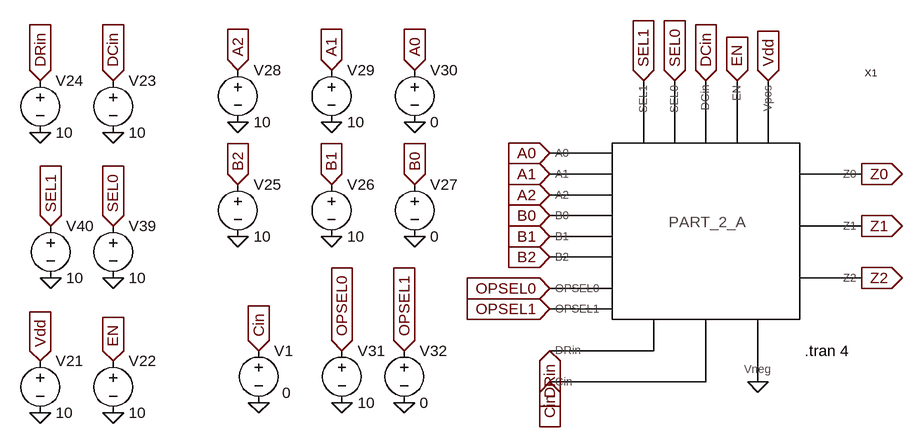
[diagram p0: schematic PART_2_A_TESTING.asc]
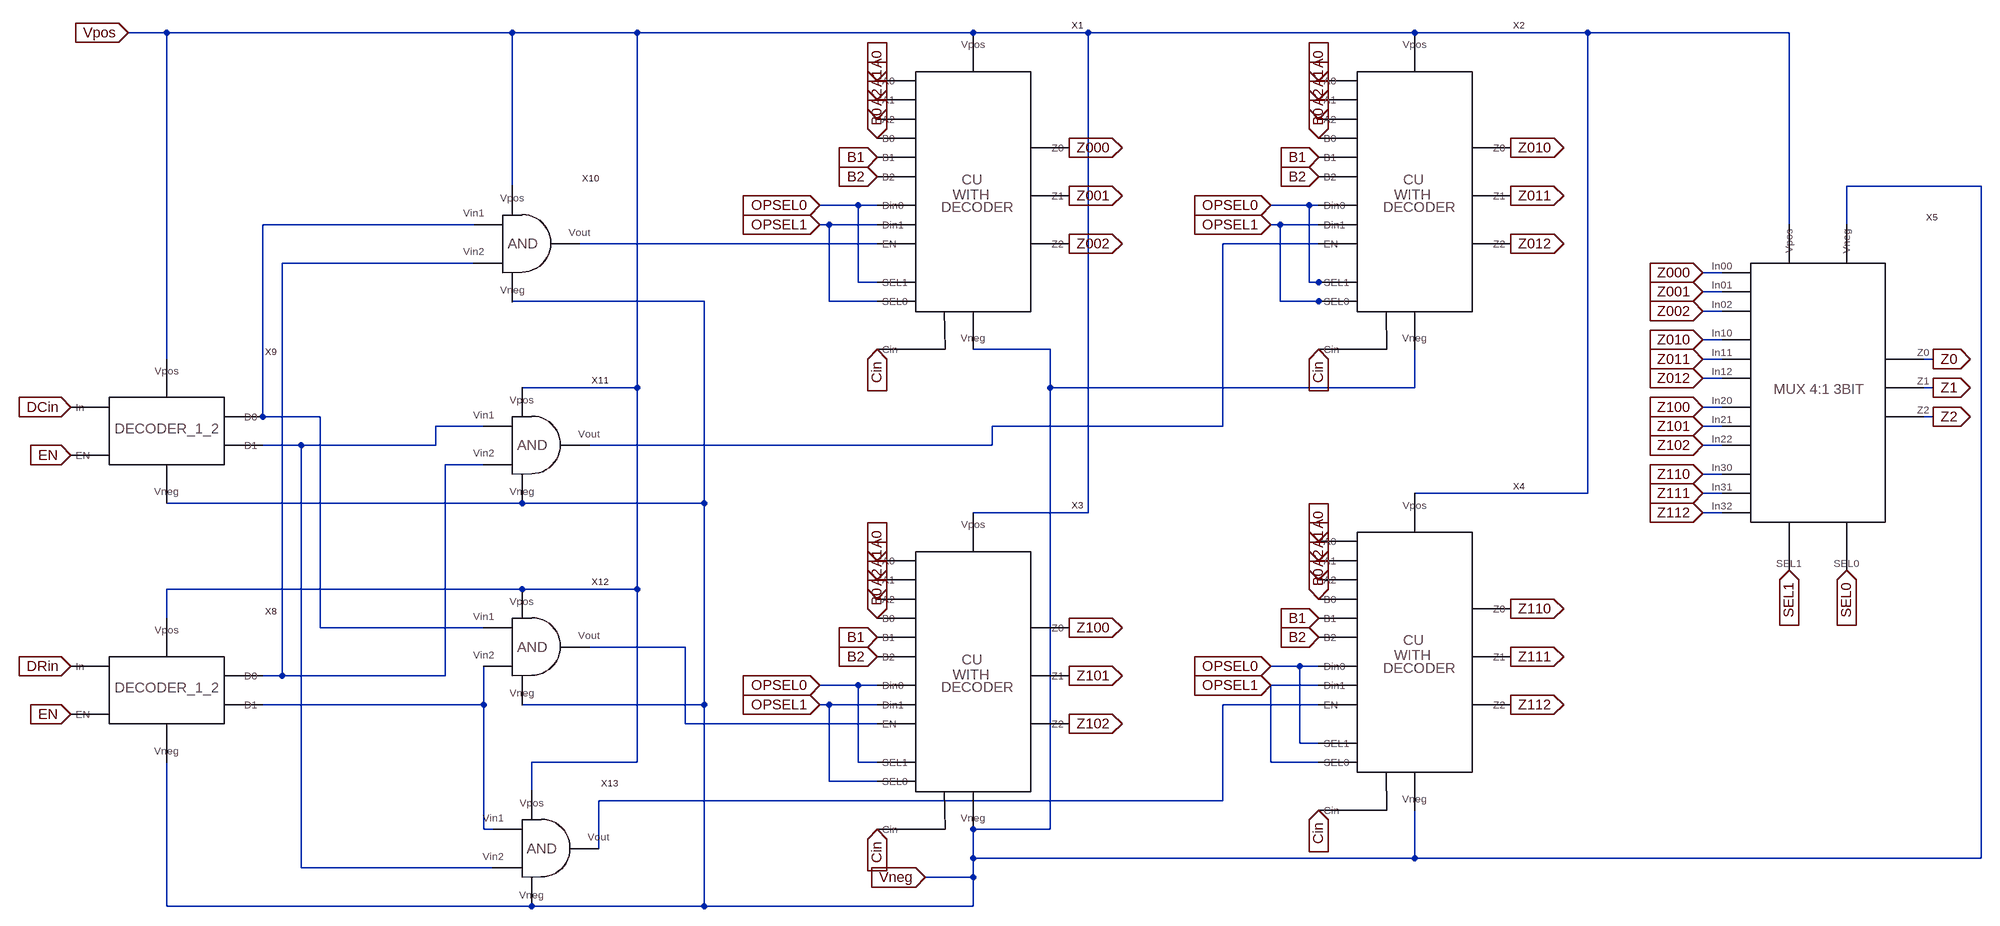
[diagram p1: sub-circuit part_2_a_sym.asc]
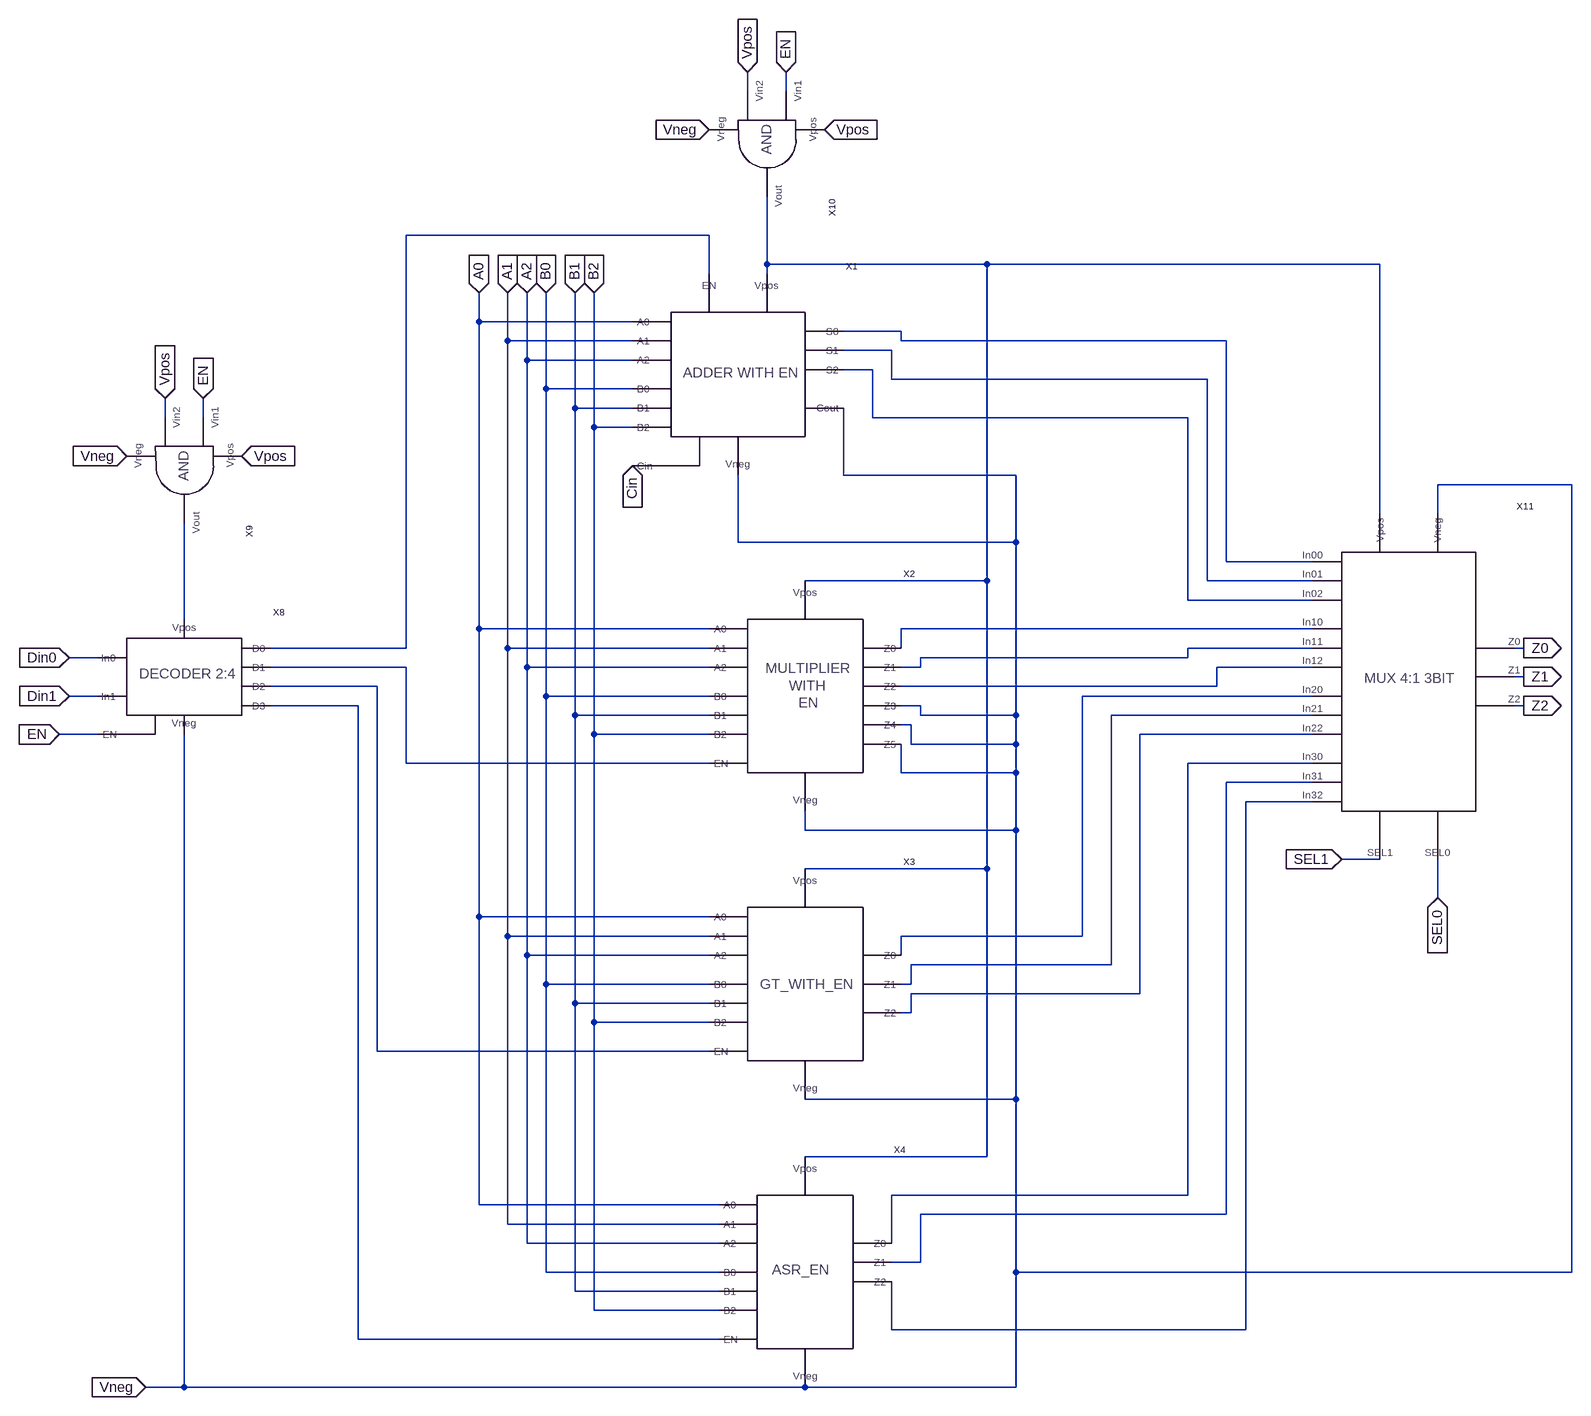
[diagram p2: sub-circuit part_2_b_sym.asc]
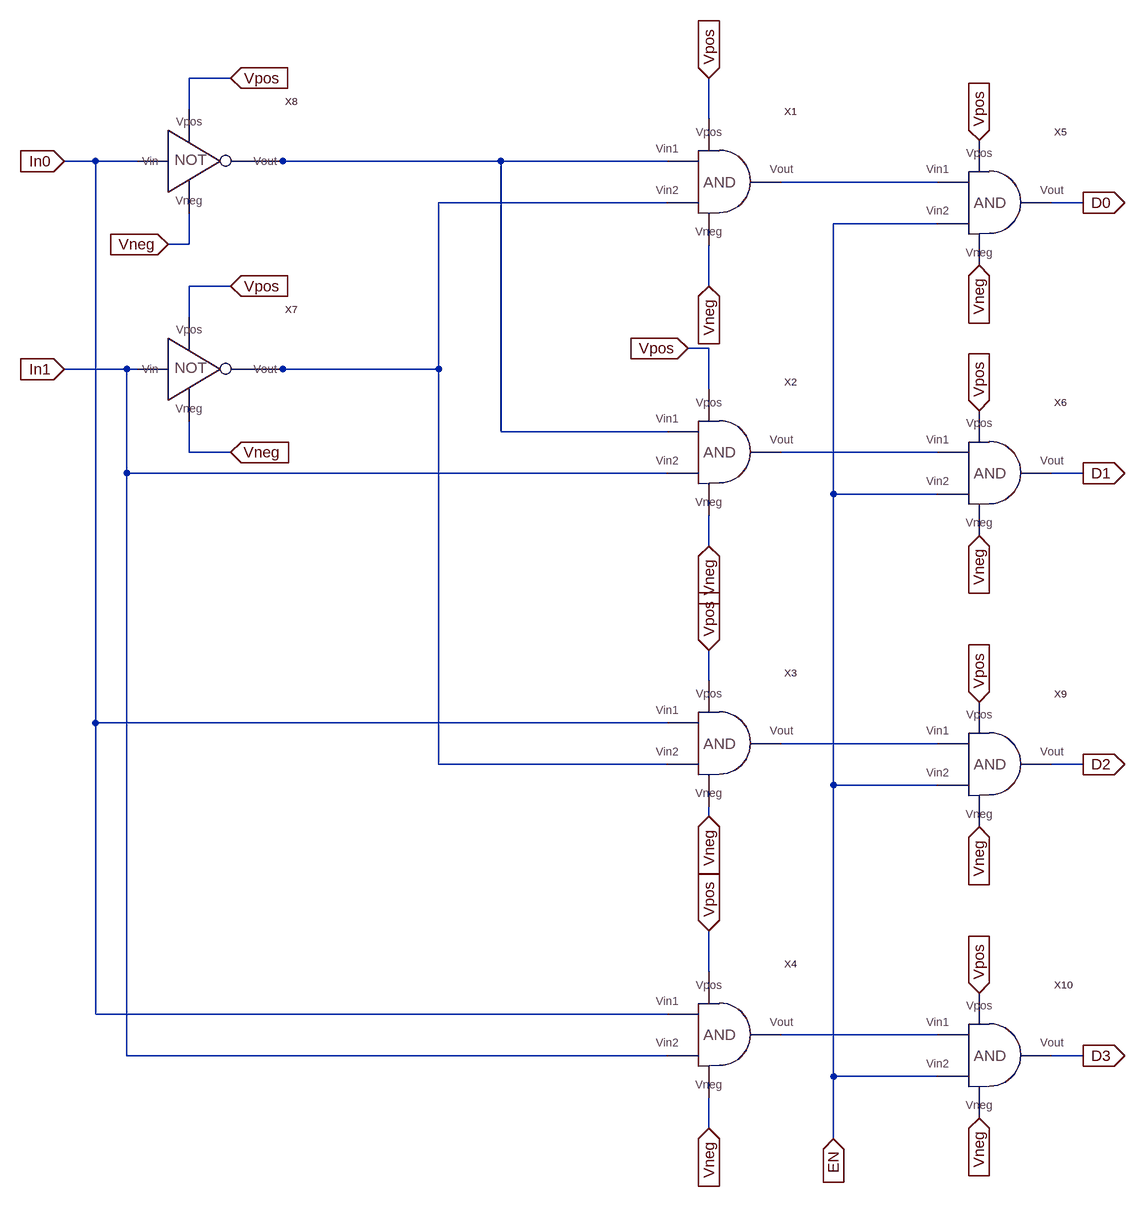
[diagram p3: sub-circuit decoder2_4.asc]
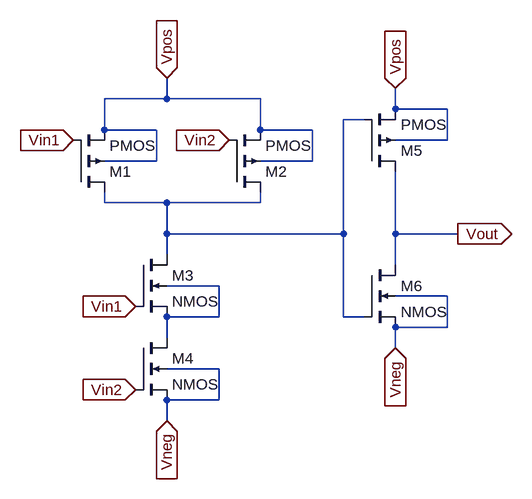
[diagram p4: sub-circuit and_sym.asc]
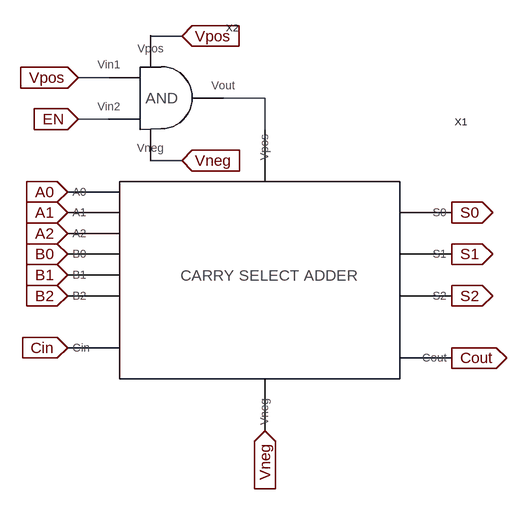
[diagram p5: sub-circuit adder_en_sym.asc]
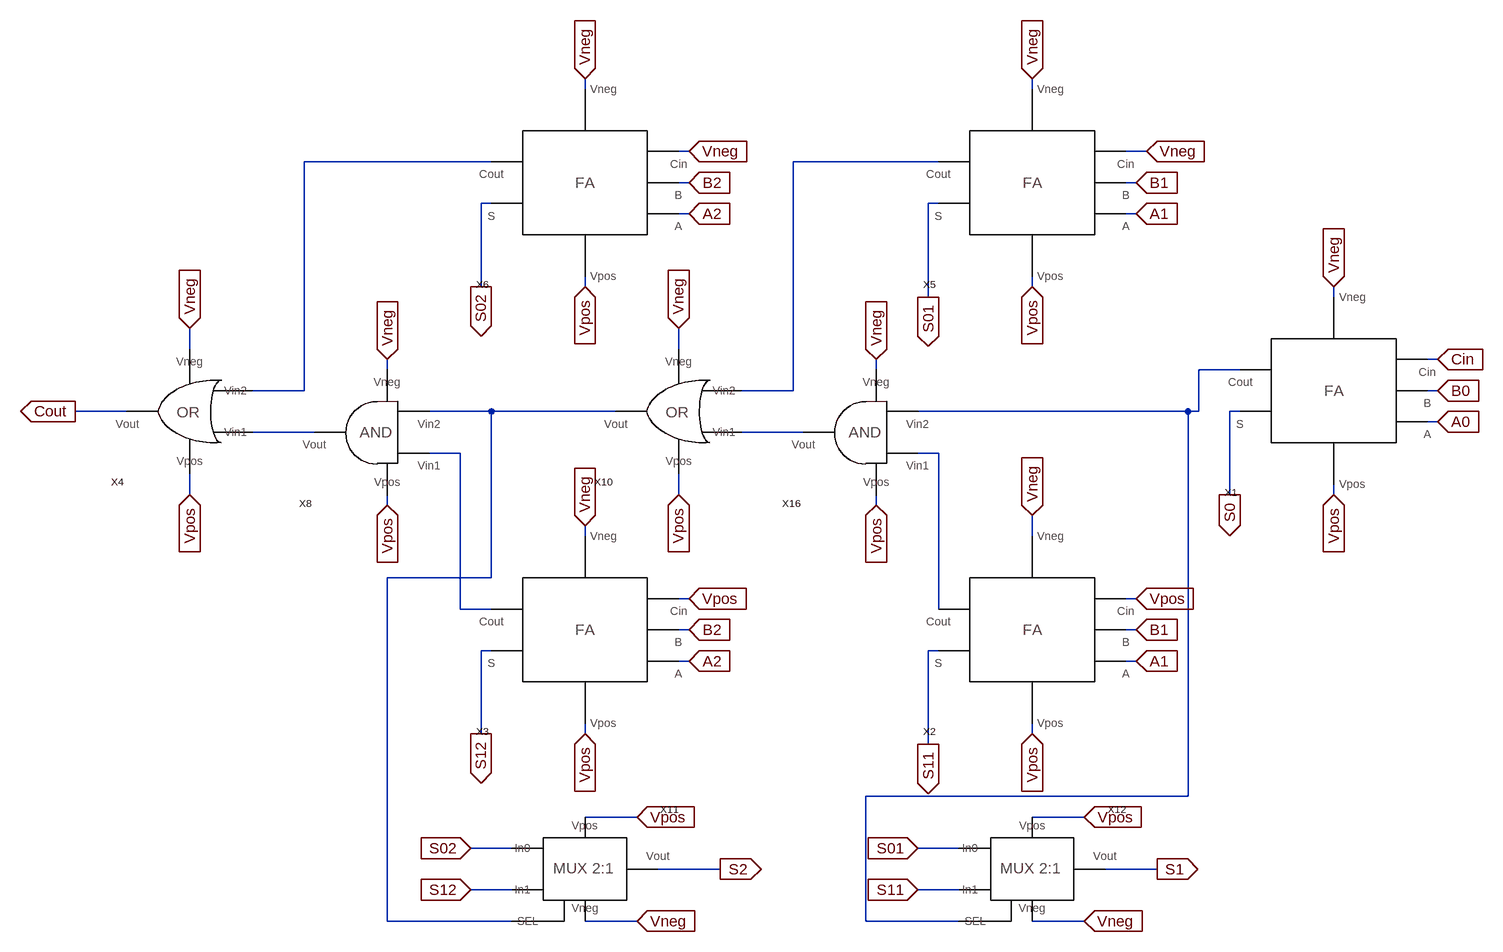
[diagram p6: sub-circuit carry_select_adder_sym.asc]
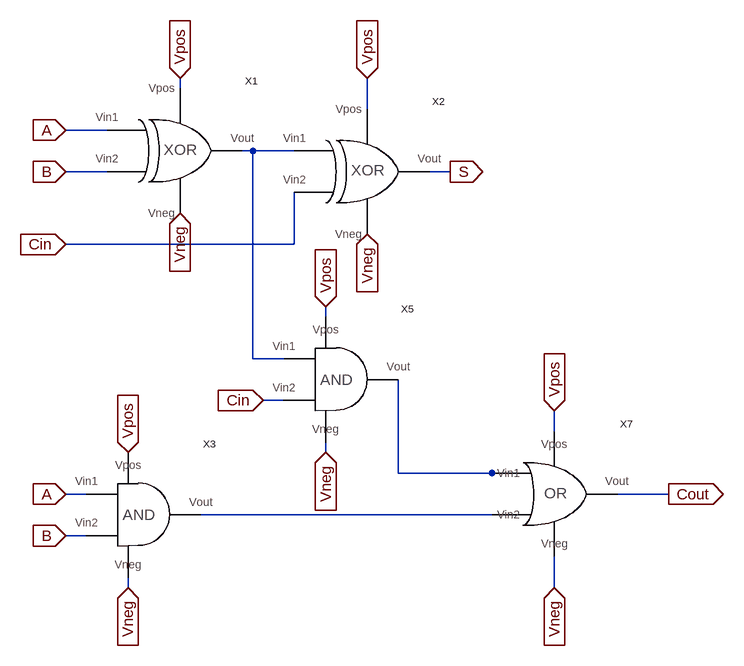
[diagram p7: sub-circuit full_adder_sym.asc]
PART_2_A_TESTING.asc, the LTspice schematic file:
Version 4
SHEET 1 5000 1080
FLAG 3232 -208 A0
IOPIN 3232 -208 In
FLAG 3232 -176 A1
IOPIN 3232 -176 In
FLAG 3232 -144 A2
IOPIN 3232 -144 In
FLAG 3232 -112 B0
IOPIN 3232 -112 In
FLAG 3232 -80 B1
IOPIN 3232 -80 In
FLAG 3232 -48 B2
IOPIN 3232 -48 In
FLAG 3424 -320 SEL0
IOPIN 3424 -320 In
FLAG 3232 96 DRin
IOPIN 3232 96 In
FLAG 3712 -176 Z0
IOPIN 3712 -176 Out
FLAG 3712 -96 Z1
IOPIN 3712 -96 Out
FLAG 3712 -16 Z2
IOPIN 3712 -16 Out
FLAG 2448 112 Vdd
IOPIN 2448 112 In
FLAG 2560 -320 DCin
IOPIN 2560 -320 In
FLAG 2448 -320 DRin
IOPIN 2448 -320 In
FLAG 2560 112 EN
IOPIN 2560 112 In
FLAG 2752 -336 A2
IOPIN 2752 -336 In
FLAG 2896 -336 A1
IOPIN 2896 -336 In
FLAG 3024 -336 A0
IOPIN 3024 -336 In
FLAG 2752 -160 B2
IOPIN 2752 -160 In
FLAG 2896 -160 B1
IOPIN 2896 -160 In
FLAG 3024 -160 B0
IOPIN 3024 -160 In
FLAG 2448 192 0
FLAG 2560 192 0
FLAG 2560 -240 0
FLAG 2448 -240 0
FLAG 3024 -256 0
FLAG 2896 -256 0
FLAG 2752 -256 0
FLAG 2752 -80 0
FLAG 2896 -80 0
FLAG 3024 -80 0
FLAG 2560 -96 SEL0
IOPIN 2560 -96 In
FLAG 2464 -96 SEL1
IOPIN 2464 -96 In
FLAG 2912 96 OPSEL0
IOPIN 2912 96 In
FLAG 3008 96 OPSEL1
IOPIN 3008 96 In
FLAG 2912 176 0
FLAG 3008 176 0
FLAG 2464 -16 0
FLAG 2560 -16 0
FLAG 3552 144 0
FLAG 3568 -320 Vdd
IOPIN 3568 -320 In
FLAG 3520 -320 EN
IOPIN 3520 -320 In
FLAG 3472 -320 DCin
IOPIN 3472 -320 In
FLAG 3376 -320 SEL1
IOPIN 3376 -320 In
FLAG 3232 144 Cin
IOPIN 3232 144 In
FLAG 2784 96 Cin
IOPIN 2784 96 In
FLAG 2784 176 0
FLAG 3232 32 OPSEL1
IOPIN 3232 32 In
FLAG 3232 0 OPSEL0
IOPIN 3232 0 In
SYMBOL voltage 2448 96 R0
WINDOW 123 0 0 Left 0
WINDOW 39 0 0 Left 0
SYMATTR InstName V21
SYMATTR Value 10
SYMBOL voltage 2560 96 R0
WINDOW 123 0 0 Left 0
WINDOW 39 0 0 Left 0
SYMATTR InstName V22
SYMATTR Value 10
SYMBOL voltage 2560 -336 R0
WINDOW 123 0 0 Left 0
WINDOW 39 0 0 Left 0
SYMATTR InstName V23
SYMATTR Value 10
SYMBOL voltage 2448 -336 R0
WINDOW 123 0 0 Left 0
WINDOW 39 0 0 Left 0
SYMATTR InstName V24
SYMATTR Value 10
SYMBOL voltage 2752 -176 R0
WINDOW 123 0 0 Left 0
WINDOW 39 0 0 Left 0
SYMATTR InstName V25
SYMATTR Value 10
SYMBOL voltage 2896 -176 R0
WINDOW 123 0 0 Left 0
WINDOW 39 0 0 Left 0
SYMATTR InstName V26
SYMATTR Value 10
SYMBOL voltage 3024 -176 R0
WINDOW 123 0 0 Left 0
WINDOW 39 0 0 Left 0
SYMATTR InstName V27
SYMATTR Value 0
SYMBOL voltage 2752 -352 R0
WINDOW 123 0 0 Left 0
WINDOW 39 0 0 Left 0
SYMATTR InstName V28
SYMATTR Value 10
SYMBOL voltage 2896 -352 R0
WINDOW 123 0 0 Left 0
WINDOW 39 0 0 Left 0
SYMATTR InstName V29
SYMATTR Value 10
SYMBOL voltage 3024 -352 R0
WINDOW 123 0 0 Left 0
WINDOW 39 0 0 Left 0
SYMATTR InstName V30
SYMATTR Value 0
SYMBOL voltage 2912 80 R0
WINDOW 123 0 0 Left 0
WINDOW 39 0 0 Left 0
SYMATTR InstName V31
SYMATTR Value 10
SYMBOL voltage 3008 80 R0
WINDOW 123 0 0 Left 0
WINDOW 39 0 0 Left 0
SYMATTR InstName V32
SYMATTR Value 0
SYMBOL voltage 2560 -112 R0
WINDOW 123 0 0 Left 0
WINDOW 39 0 0 Left 0
SYMATTR InstName V39
SYMATTR Value 10
SYMBOL voltage 2464 -112 R0
WINDOW 123 0 0 Left 0
WINDOW 39 0 0 Left 0
SYMATTR InstName V40
SYMATTR Value 10
SYMBOL PART_2_A_SYM 3472 -48 R0
SYMATTR InstName X1
SYMBOL voltage 2784 80 R0
WINDOW 123 0 0 Left 0
WINDOW 39 0 0 Left 0
WINDOW 3 36 81 Left 2
SYMATTR Value 0
SYMATTR InstName V1
TEXT 3624 96 Left 2 !.tran 4

The netlist it stands for:
* PART_2_A_TESTING.asc
V21 Vdd 0 10
V22 EN 0 10
V23 DCin 0 10
V24 DRin 0 10
V25 B2 0 10
V26 B1 0 10
V27 B0 0 0
V28 A2 0 10
V29 A1 0 10
V30 A0 0 0
V31 OPSEL0 0 10
V32 OPSEL1 0 0
V39 SEL0 0 10
V40 SEL1 0 10
XX1 A0 A1 A2 B0 B1 B2 OPSEL0 OPSEL1 DRin Cin 0 Z2 Z1 Z0 Vdd EN DCin SEL0 SEL1 part_2_a_sym
V1 Cin 0 0

* block symbol definitions
.subckt part_2_a_sym A0 A1 A2 B0 B1 B2 OPSEL0 OPSEL1 DRin Cin Vneg Z2 Z1 Z0 Vpos EN DCin SEL0 SEL1
XX1 A0 A1 A2 B0 B1 B2 OPSEL0 OPSEL1 N002 OPSEL0 OPSEL1 Vpos Vneg Z000 Z001 Z002 Cin part_2_b_sym
XX2 A0 A1 A2 B0 B1 B2 OPSEL0 OPSEL1 N003 OPSEL0 OPSEL1 Vpos Vneg Z010 Z011 Z012 Cin part_2_b_sym
XX3 A0 A1 A2 B0 B1 B2 OPSEL0 OPSEL1 N006 OPSEL0 OPSEL1 Vpos Vneg Z100 Z101 Z102 Cin part_2_b_sym
XX4 A0 A1 A2 B0 B1 B2 OPSEL0 OPSEL1 N008 OPSEL0 OPSEL1 Vpos Vneg Z110 Z111 Z112 Cin part_2_b_sym
XX8 DRin EN Vpos Vneg N004 N007 decoder_1_2_sym
XX9 DCin EN Vpos Vneg N001 N005 decoder_1_2_sym
XX10 N001 N004 Vpos Vneg N002 and_sym
XX11 N005 N004 Vpos Vneg N003 and_sym
XX12 N001 N007 Vpos Vneg N006 and_sym
XX13 N007 N005 Vpos Vneg N008 and_sym
XX5 Vpos Vneg Z000 Z001 Z002 Z010 Z011 Z012 Z100 Z101 Z102 Z110 Z111 Z112 Z0 Z1 Z2 SEL0 SEL1 mux3bit_sym
.ends part_2_a_sym

.subckt part_2_b_sym A0 A1 A2 B0 B1 B2 Din0 Din1 EN SEL1 SEL0 Vpos Vneg Z0 Z1 Z2 Cin
XX8 Din0 Din1 N001 N009 N011 N013 Vneg N006 EN decoder2_4
XX1 A0 A1 A2 B0 B1 B2 N002 N001 Vneg N003 N004 N005 Vneg Cin adder_en_sym
XX2 A0 A1 A2 B0 B1 B2 N009 N002 N007 Vneg N008 N010 Vneg Vneg Vneg multiplier_en_sym
XX3 A0 A1 A2 B0 B1 B2 N011 N002 N012 N014 N015 Vneg gt_en_sym
XX4 N002 A0 A1 A2 B0 B1 B2 N013 Vneg N016 N017 N018 asr_en_sym
XX9 EN Vpos Vpos Vneg N006 and_sym
XX10 EN Vpos Vpos Vneg N002 and_sym
XX11 N002 Vneg N003 N004 N005 N007 N008 N010 N012 N014 N015 N016 N017 N018 Z0 Z1 Z2 SEL0 SEL1 mux3bit_sym
.ends part_2_b_sym

.subckt decoder2_4 In0 In1 D0 D1 D2 D3 Vneg Vpos EN
XX1 N001 N003 Vpos Vneg N002 and_sym
XX2 N001 In1 Vpos Vneg N004 and_sym
XX3 In0 N003 Vpos Vneg N005 and_sym
XX4 In0 In1 Vpos Vneg N006 and_sym
XX7 In1 Vpos N003 Vneg NOT_SYM  ; pins Vin Vpos Vout Vneg
XX8 In0 Vpos N001 Vneg NOT_SYM  ; pins Vin Vpos Vout Vneg
XX5 N002 EN Vpos Vneg D0 and_sym
XX6 N004 EN Vpos Vneg D1 and_sym
XX9 N005 EN Vpos Vneg D2 and_sym
XX10 N006 EN Vpos Vneg D3 and_sym
.ends decoder2_4

.subckt and_sym Vin1 Vin2 Vpos Vneg Vout
M1 N001 Vin1 Vpos Vpos PMOS
M2 N001 Vin2 Vpos Vpos PMOS
M3 N001 Vin1 N002 N002 NMOS
M4 N002 Vin2 Vneg Vneg NMOS
M5 Vout N001 Vpos Vpos PMOS
M6 Vout N001 Vneg Vneg NMOS
.ends and_sym

.subckt adder_en_sym A0 A1 A2 B0 B1 B2 Vpos EN Vneg S0 S1 S2 Cout Cin
XX1 A0 A1 A2 B0 B1 B2 Cout N001 Vneg S0 S1 S2 Cin carry_select_adder_sym
XX2 Vpos EN Vpos Vneg N001 and_sym
.ends adder_en_sym

.subckt carry_select_adder_sym A0 A1 A2 B0 B1 B2 Cout Vpos Vneg S0 S1 S2 Cin
XX1 A0 B0 Cin S0 N003 Vpos Vneg full_adder_sym
XX2 A1 B1 Vpos S11 N008 Vpos Vneg full_adder_sym
XX3 A2 B2 Vpos S12 N007 Vpos Vneg full_adder_sym
XX5 A1 B1 Vneg S01 N002 Vpos Vneg full_adder_sym
XX6 A2 B2 Vneg S02 N001 Vpos Vneg full_adder_sym
XX10 Vpos N006 N002 N004 Vneg or_sym
XX11 S02 S12 N004 Vpos Vneg S2 mux2_1
XX12 S01 S11 N003 Vpos Vneg S1 mux2_1
XX16 N008 N003 Vpos Vneg N006 and_sym
XX4 Vpos N005 N001 Cout Vneg or_sym
XX8 N007 N004 Vpos Vneg N005 and_sym
.ends carry_select_adder_sym

.subckt full_adder_sym A B Cin S Cout Vpos Vneg
XX1 A B Vpos N001 Vneg xor_sym
XX2 N001 Cin Vpos S Vneg xor_sym
XX3 A B Vpos Vneg N003 and_sym
XX5 N001 Cin Vpos Vneg N002 and_sym
XX7 Vpos N002 N003 Cout Vneg or_sym
.ends full_adder_sym

.subckt xor_sym Vin1 Vin2 Vpos Vout Vneg
M1 N002 Vin1` N001 N001 PMOS
M2 N001 Vin1 Vpos Vpos PMOS
M3 N002 Vin1 N003 N003 NMOS
M4 N003 Vin2` Vneg Vneg NMOS
M5 Vout N002 Vneg Vneg NMOS
M6 Vout N002 Vpos Vpos PMOS
M7 N002 Vin2 N001 N001 PMOS
M8 N001 Vin2` Vpos Vpos PMOS
M9 N002 Vin1` N004 N004 NMOS
M10 N004 Vin2 Vneg Vneg NMOS
M11 Vin1` Vin1 Vneg Vneg NMOS
M12 Vin1` Vin1 Vpos Vpos PMOS
M13 Vin2` Vin2 Vneg Vneg NMOS
M14 Vin2` Vin2 Vpos Vpos PMOS
.ends xor_sym

.subckt or_sym Vpos Vin1 Vin2 Vout Vneg
M1 N002 Vin1 Vpos Vpos PMOS
M2 N001 Vin2 N002 N002 PMOS
M3 N001 Vin2 Vneg Vneg NMOS
M4 N001 Vin1 Vneg Vneg NMOS
M5 Vout N001 Vpos Vpos PMOS
M6 Vout N001 Vneg Vneg NMOS
.ends or_sym

.subckt mux2_1 In0 In1 SEL Vpos Vneg Vout
XX1 In1 SEL Vpos Vneg N003 and_sym
XX2 In0 N002 Vpos Vneg N001 and_sym
XX4 Vpos N001 N003 Vout Vneg or_sym
XX5 SEL Vpos N002 Vneg NOT_SYM  ; pins Vin Vpos Vout Vneg
.ends mux2_1

.subckt multiplier_en_sym A0 A1 A2 B0 B1 B2 EN Vpos Z0 Vneg Z1 Z2 Z3 Z4 Z5
XX1 A0 A1 A2 B0 B1 B2 N001 Vneg Z0 Z1 Z2 Z3 Z4 Z5 multiplier_sym
XX2 Vpos EN Vpos Vneg N001 and_sym
.ends multiplier_en_sym

.subckt multiplier_sym A0 A1 A2 B0 B1 B2 Vpos Vneg Z0 Z1 Z2 Z3 Z4 Z5
XX2 B0 A0 Vpos Vneg Z0 and_sym
XX4 B0 A1 Vpos Vneg N001 and_sym
XX5 A2 B0 Vpos Vneg N003 and_sym
XX1 N001 N003 Vneg N006 N008 N010 N005 Vpos Vneg Z1 N002 N004 Vneg carry_select_adder_sym
XX3 N002 N004 N005 N007 N009 N011 Z5 Vpos Vneg Z2 Z3 Z4 Vneg carry_select_adder_sym
XX9 B1 A0 Vpos Vneg N006 and_sym
XX10 B1 A1 Vpos Vneg N008 and_sym
XX11 A2 B1 Vpos Vneg N010 and_sym
XX12 B2 A0 Vpos Vneg N007 and_sym
XX13 B2 A1 Vpos Vneg N009 and_sym
XX14 A2 B2 Vpos Vneg N011 and_sym
.ends multiplier_sym

.subckt gt_en_sym A0 A1 A2 B0 B1 B2 EN Vpos Z0 Z1 Z2 Vneg
XX1 A0 A1 A2 B0 B1 B2 Z0 Z1 Z2 N001 Vneg gt_sym
XX2 Vpos EN Vpos Vneg N001 and_sym
.ends gt_en_sym

.subckt gt_sym A0 A1 A2 B0 B1 B2 Z0 Z1 Z2 Vpos Vneg
XX22 Vpos A0 N009 Vpos Vneg Z0 mux2_1
XX23 Vpos A1 N009 Vpos Vneg Z1 mux2_1
XX24 Vpos A2 N009 Vpos Vneg Z2 mux2_1
XX25 Vpos N007 N012 N009 Vneg or_sym
XX1 A2 B2 Vpos N013 Vneg xnor_sym
XX2 A2 P001 Vpos Vneg N008 and_sym
XX3 B2 Vpos P001 Vneg NOT_SYM  ; pins Vin Vpos Vout Vneg
XX4 A1 P002 Vpos Vneg N006 and_sym
XX5 B1 Vpos P002 Vneg NOT_SYM  ; pins Vin Vpos Vout Vneg
XX8 A0 P003 Vpos Vneg N001 and_sym
XX9 B0 Vpos P003 Vneg NOT_SYM  ; pins Vin Vpos Vout Vneg
XX10 A1 B1 Vpos N014 Vneg xnor_sym
XX11 B0 A0 Vpos N015 Vneg xnor_sym
XX12 N013 N014 Vpos Vneg N003 and_sym
XX13 N001 N003 Vpos Vneg N002 and_sym
XX14 N003 N015 Vpos Vneg N011 and_sym
XX15 Vpos N002 N005 N004 Vneg or_sym
XX16 Vpos N004 N008 N007 Vneg or_sym
XX17 N006 N013 Vpos Vneg N005 and_sym
XX6 N007 N011 Vpos N010 Vneg xnor_sym
XX7 N010 N011 Vpos N012 Vneg xnor_sym
.ends gt_sym

.subckt xnor_sym Vin1 Vin2 Vpos Vout Vneg
M1 Vout Vin1` N001 N001 PMOS
M2 N001 Vin1 Vpos Vpos PMOS
M3 Vout Vin1 N002 N002 NMOS
M4 N002 Vin2` Vneg Vneg NMOS
M7 Vout Vin2 N001 N001 PMOS
M8 N001 Vin2` Vpos Vpos PMOS
M9 Vout Vin1` N003 N003 NMOS
M10 N003 Vin2 Vneg Vneg NMOS
M11 Vin1` Vin1 Vneg Vneg NMOS
M12 Vin1` Vin1 Vpos Vpos PMOS
M13 Vin2` Vin2 Vneg Vneg NMOS
M14 Vin2` Vin2 Vpos Vpos PMOS
.ends xnor_sym

.subckt asr_en_sym Vpos A0 A1 A2 B0 B1 B2 EN Vneg Z0 Z1 Z2
XX1 A0 A1 A2 B0 B1 B2 Z0 Z1 Z2 N001 Vneg asr_symbol
XX2 Vpos EN Vpos Vneg N001 and_sym
.ends asr_en_sym

.subckt asr_symbol A0 A1 A2 B0 B1 B2 Z0 Z1 Z2 Vpos Vneg
XX1 Vpos A0 A1 A2 A2 A2 A2 A2 A2 B1 B2 B0 Z0 Vneg mux_8_1_symbol
XX2 Vpos A1 A2 A2 A2 A2 A2 A2 A2 B1 B2 B0 Z1 Vneg mux_8_1_symbol
XX3 Vpos A2 A2 A2 A2 A2 A2 A2 A2 B1 B2 B0 Z2 Vneg mux_8_1_symbol
.ends asr_symbol

.subckt mux_8_1_symbol Vpos In0 In1 In2 In3 In4 In5 In6 In7 SEL1 SEL2 SEL0 Vout Vneg
XX1 N001 Vpos Vneg In0 In1 In2 In3 SEL1 SEL0 mux4_1_sym
XX2 N002 Vpos Vneg In4 In5 In6 In7 SEL1 SEL0 mux4_1_sym
XX3 N001 N002 SEL2 Vpos Vneg Vout mux2_1
.ends mux_8_1_symbol

.subckt mux4_1_sym Vout Vpos Vneg In0 In1 In2 In3 SEL1 SEL0
XX1 In0 In1 SEL0 Vpos Vneg N001 mux2_1
XX2 N001 N002 SEL1 Vpos Vneg Vout mux2_1
XX3 In2 In3 SEL0 Vpos Vneg N002 mux2_1
.ends mux4_1_sym

.subckt mux3bit_sym Vpos Vneg In00 In01 In02 In10 In11 In12 In20 In21 In22 In30 In31 In32 Z0 Z1 Z2 SEL0 SEL1
XX1 Z0 Vpos Vneg In00 In10 In20 In30 SEL1 SEL0 mux4_1_sym
XX2 Z1 Vpos Vneg In01 In11 In21 In31 SEL1 SEL0 mux4_1_sym
XX3 Z2 Vpos Vneg In02 In12 In22 In32 SEL1 SEL0 mux4_1_sym
.ends mux3bit_sym

.subckt decoder_1_2_sym In EN Vpos Vneg D0 D1
XX1 P001 EN Vpos Vneg D0 and_sym
XX2 In Vpos P001 Vneg NOT_SYM  ; pins Vin Vpos Vout Vneg
XX5 In EN Vpos Vneg D1 and_sym
.ends decoder_1_2_sym

.model NMOS NMOS
.model PMOS PMOS
.lib standard.mos
.tran 4
.backanno
.end

* Results of the author's LTspice run, read from the files saved beside the schematic
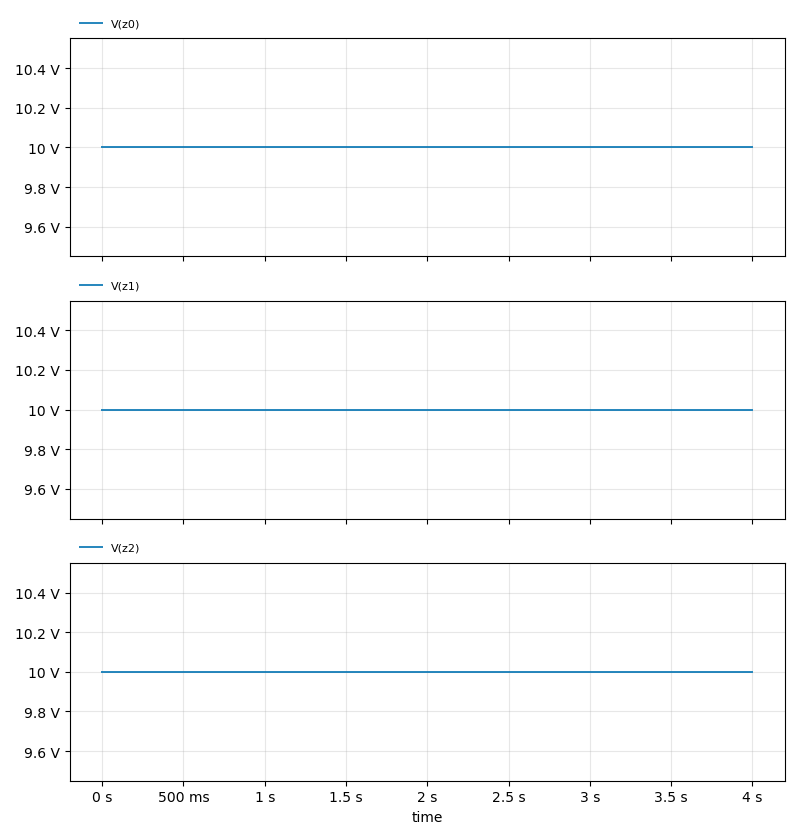
[diagram p8: Transient Analysis of PART_2_A_TESTING.asc, plotted from the saved traces]
* Transient Analysis, 1 run:
*   V(z0): min 10 V, max 10 V, average 10 V, rms 10 V, last 10 V
*   V(z1): min 10 V, max 10 V, average 10 V, rms 10 V, last 10 V
*   V(z2): min 10 V, max 10 V, average 10 V, rms 10 V, last 10 V